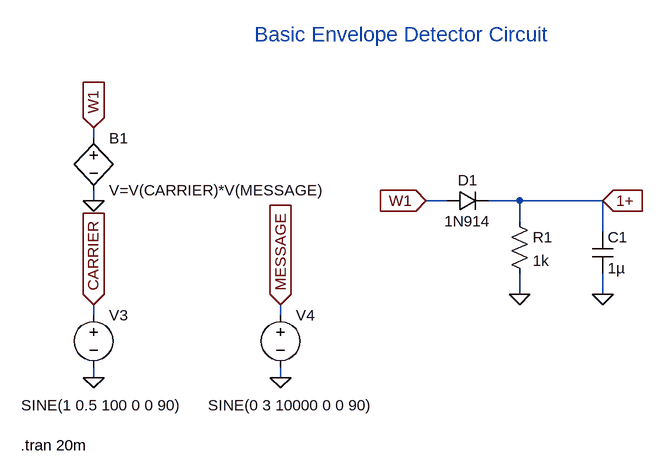
[diagram p0: schematic env_detector_ltspice.asc]
env_detector_ltspice.asc, the LTspice schematic file:
Version 4
SHEET 1 880 724
WIRE -352 128 -352 112
WIRE -352 224 -352 208
WIRE 192 224 160 224
WIRE 304 224 256 224
WIRE 432 224 304 224
WIRE 304 256 304 224
WIRE 432 272 432 224
WIRE 304 368 304 336
WIRE 432 368 432 336
WIRE -352 400 -352 384
WIRE -64 400 -64 384
WIRE -352 496 -352 480
WIRE -64 496 -64 480
FLAG 304 368 0
FLAG 432 368 0
FLAG 160 224 W1
IOPIN 160 224 In
FLAG 432 224 1+
IOPIN 432 224 In
FLAG -352 224 0
FLAG -352 112 W1
IOPIN -352 112 In
FLAG -352 496 0
FLAG -64 496 0
FLAG -352 384 CARRIER
IOPIN -352 384 In
FLAG -64 384 MESSAGE
IOPIN -64 384 In
SYMBOL diode 192 240 R270
WINDOW 0 32 32 VTop 2
WINDOW 3 0 32 VBottom 2
SYMATTR InstName D1
SYMATTR Value 1N914
SYMBOL res 288 240 R0
SYMATTR InstName R1
SYMATTR Value 1k
SYMBOL cap 416 272 R0
SYMATTR InstName C1
SYMATTR Value 1µ
SYMBOL bv -352 112 R0
SYMATTR InstName B1
SYMATTR Value V=V(CARRIER)*V(MESSAGE)
SYMBOL voltage -352 384 R0
WINDOW 3 -111 155 Left 2
WINDOW 123 0 0 Left 0
WINDOW 39 0 0 Left 0
SYMATTR Value SINE(1 0.5 100 0 0 90)
SYMATTR InstName V3
SYMBOL voltage -64 384 R0
WINDOW 3 -112 155 Left 2
WINDOW 123 0 0 Left 0
WINDOW 39 0 0 Left 0
SYMATTR Value SINE(0 3 10000 0 0 90)
SYMATTR InstName V4
TEXT -104 -32 Left 3 ;Basic Envelope Detector Circuit
TEXT -464 600 Left 2 !.tran 20m

The netlist it stands for:
* env_detector_ltspice.asc
D1 W1 1+ 1N914
R1 1+ 0 1k
C1 1+ 0 1µ
B1 W1 0 V=V(CARRIER)*V(MESSAGE)
V3 CARRIER 0 SINE(1 0.5 100 0 0 90)
V4 MESSAGE 0 SINE(0 3 10000 0 0 90)
.model D D
.lib standard.dio
* Basic Envelope Detector Circuit
.tran 20m
.backanno
.end